# Altium schematic sheet System.SchDoc
size A3; SheetNumber: 1; SheetTotal: 14
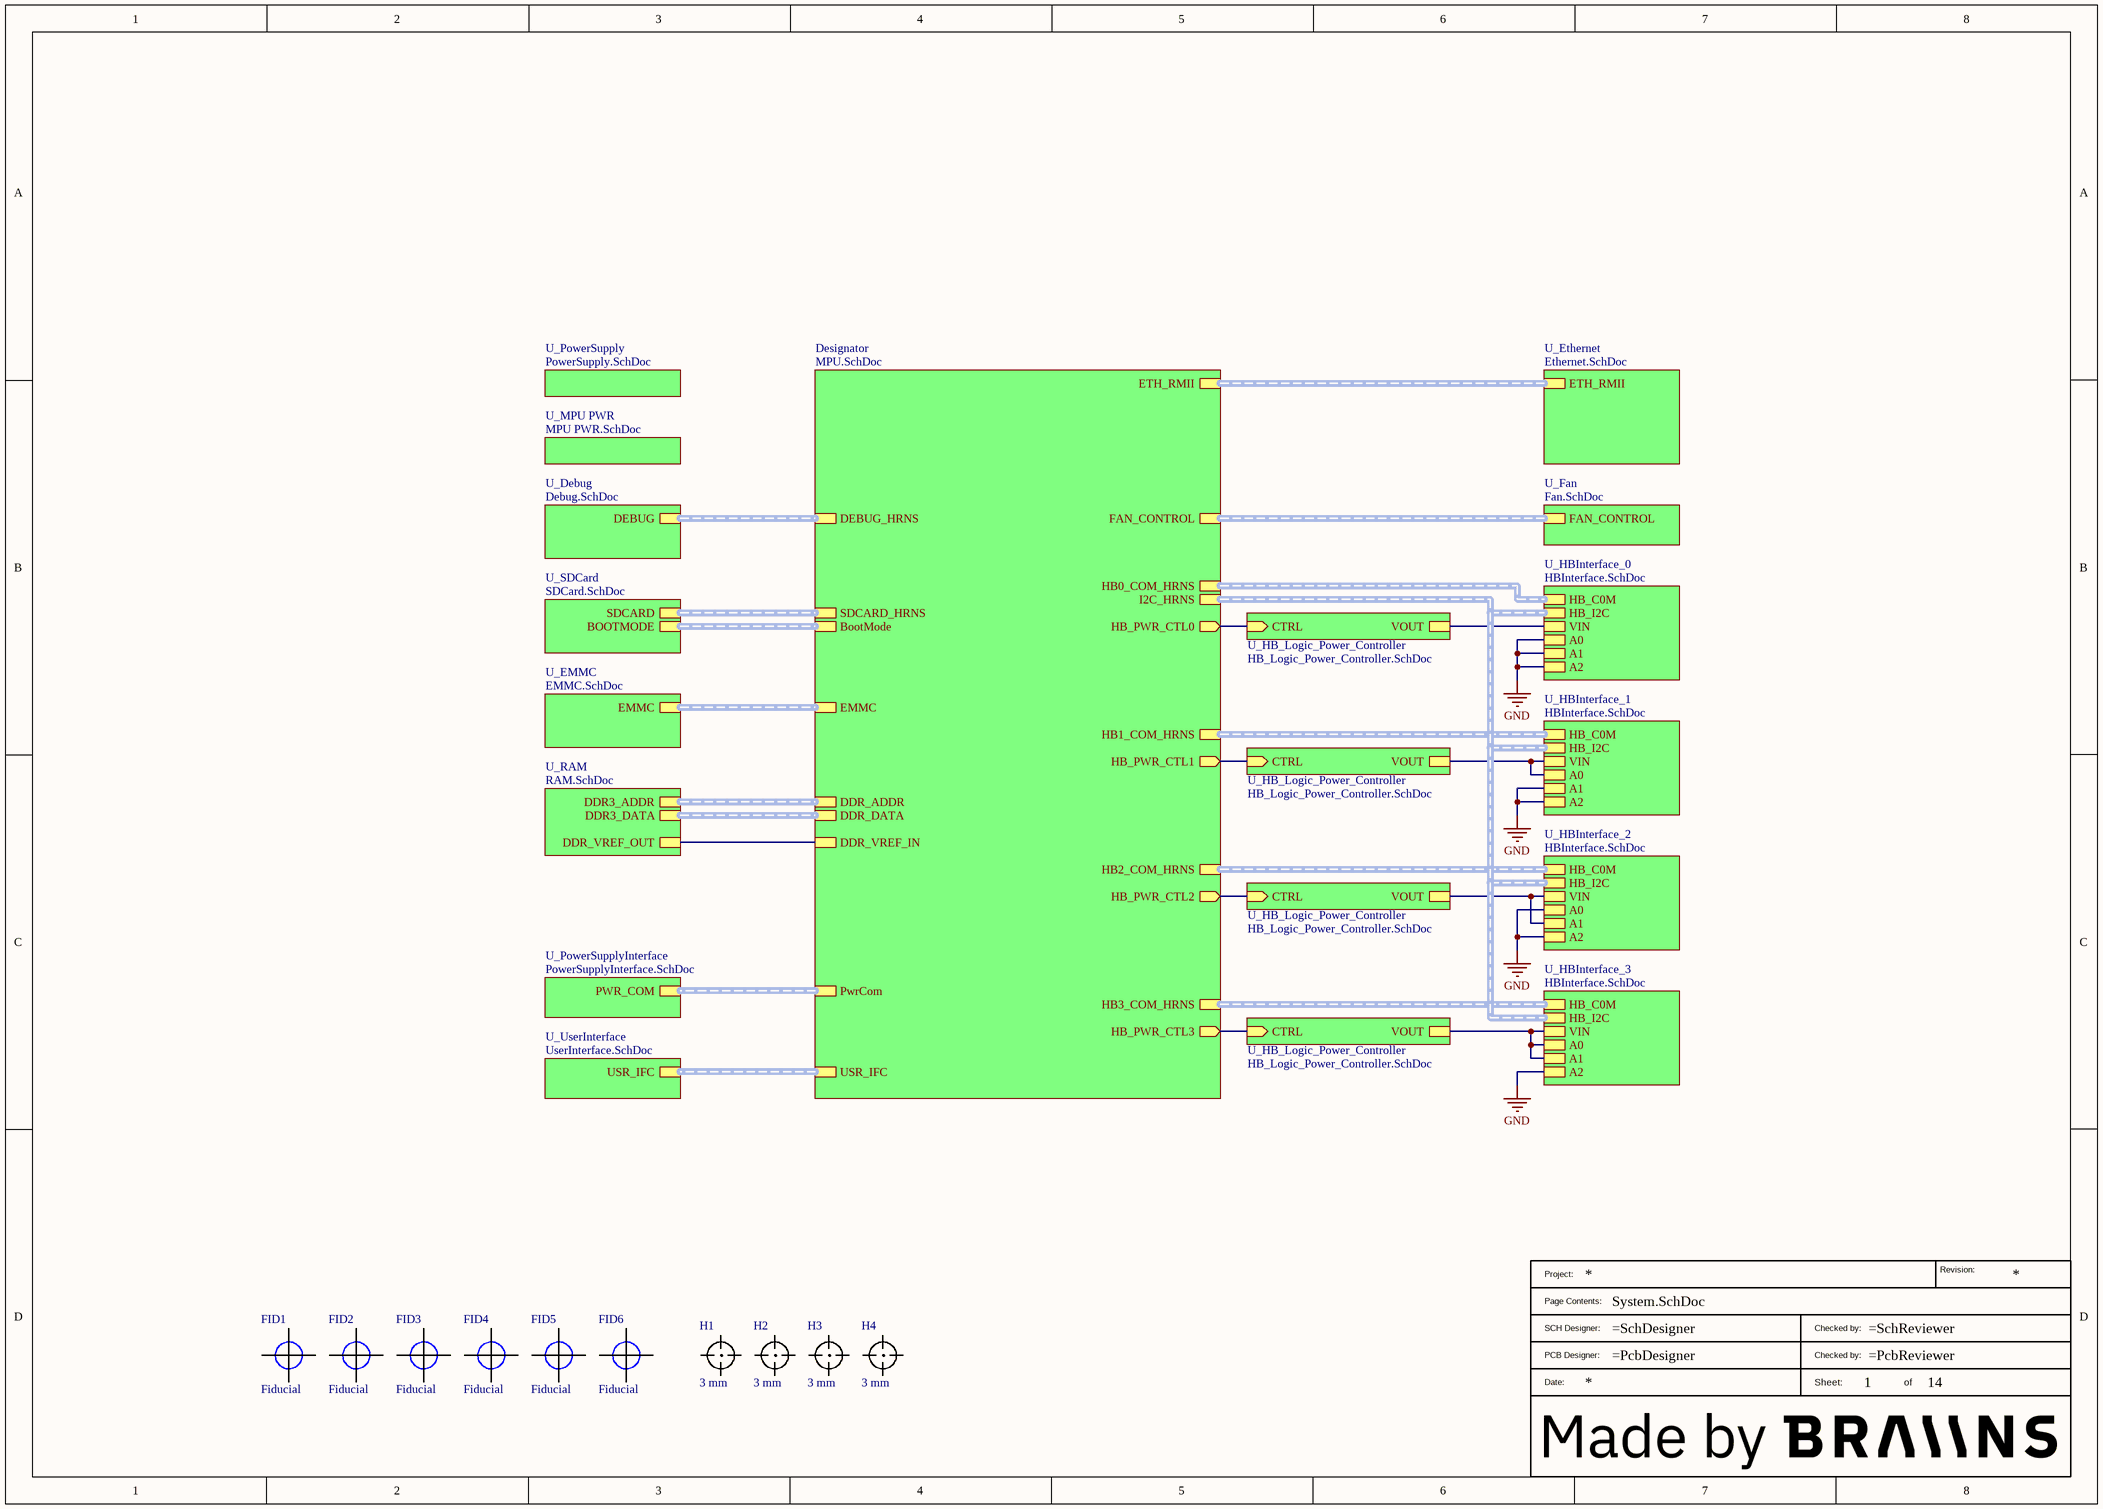
[diagram p0: System.SchDoc]

## Parts
?  BraiinsTitleBlockWithLogo  (value not drawn)  (graphical)
FID1  Fiducial  [FID_1MM]
FID2  Fiducial  [FID_1MM]
FID3  Fiducial  [FID_1MM]
FID4  Fiducial  [FID_1MM]
FID5  Fiducial  [FID_1MM]
FID6  Fiducial  [FID_1MM]
H1  3 mm  [THT_HOLE_NONPLATE_3_0]
H2  3 mm  [THT_HOLE_NONPLATE_3_0]
H3  3 mm  [THT_HOLE_NONPLATE_3_0]
H4  3 mm  [THT_HOLE_NONPLATE_3_0]

## Sub-sheets
Designator = MPU.SchDoc: DDR_ADDR (harness DDR_ADDR), DEBUG_HRNS (harness DEBUG_HRNS), DDR_DATA (harness DDR_DATA), DDR_VREF_IN, SDCARD_HRNS (harness SDCARD_HRNS), EMMC (harness EMMC), ETH_RMII (harness ETH_RMII), HB2_COM_HRNS (harness HB_COM_HRNS), HB3_COM_HRNS (harness HB_COM_HRNS), HB0_COM_HRNS (harness HB_COM_HRNS), HB1_COM_HRNS (harness HB_COM_HRNS), PwrCom (harness PwrCom), I2C_HRNS (harness I2C_HRNS), FAN_CONTROL (harness FAN_CONTROL), BootMode (harness BootMode), USR_IFC (harness USR_IFC), HB_PWR_CTL2 (out), HB_PWR_CTL1 (out), HB_PWR_CTL3 (out), HB_PWR_CTL0 (out)
U_Debug = Debug.SchDoc: DEBUG (harness DEBUG_HRNS)
U_EMMC = EMMC.SchDoc: EMMC (harness EMMC)
U_Ethernet = Ethernet.SchDoc: ETH_RMII (harness ETH_RMII)
U_Fan = Fan.SchDoc: FAN_CONTROL (harness FAN_CONTROL)
U_HB_Logic_Power_Controller = HB_Logic_Power_Controller.SchDoc: VOUT, CTRL (in)
U_HB_Logic_Power_Controller = HB_Logic_Power_Controller.SchDoc: VOUT, CTRL (in)
U_HB_Logic_Power_Controller = HB_Logic_Power_Controller.SchDoc: VOUT, CTRL (in)
U_HB_Logic_Power_Controller = HB_Logic_Power_Controller.SchDoc: VOUT, CTRL (in)
U_HBInterface_0 = HBInterface.SchDoc: HB_C0M (harness HB_COM_HRNS), HB_I2C (harness I2C_HRNS), A0, A1, A2, VIN
U_HBInterface_1 = HBInterface.SchDoc: HB_C0M (harness HB_COM_HRNS), HB_I2C (harness I2C_HRNS), A0, A1, A2, VIN
U_HBInterface_2 = HBInterface.SchDoc: HB_C0M (harness HB_COM_HRNS), HB_I2C (harness I2C_HRNS), A0, A1, A2, VIN
U_HBInterface_3 = HBInterface.SchDoc: HB_C0M (harness HB_COM_HRNS), HB_I2C (harness I2C_HRNS), A0, A1, A2, VIN
U_MPU PWR = MPU PWR.SchDoc: no entries
U_PowerSupply = PowerSupply.SchDoc: no entries
U_PowerSupplyInterface = PowerSupplyInterface.SchDoc: PWR_COM (harness PwrCom)
U_RAM = RAM.SchDoc: DDR3_ADDR (harness DDR_ADDR), DDR3_DATA (harness DDR_DATA), DDR_VREF_OUT
U_SDCard = SDCard.SchDoc: SDCARD (harness SDCARD_HRNS), BOOTMODE (harness BootMode)
U_UserInterface = UserInterface.SchDoc: USR_IFC (harness USR_IFC)

## Nets
GND: sheet U_HBInterface_0/A0, sheet U_HBInterface_0/A1, sheet U_HBInterface_0/A2, sheet U_HBInterface_1/A1, sheet U_HBInterface_1/A2, sheet U_HBInterface_2/A0, sheet U_HBInterface_2/A2, sheet U_HBInterface_3/A2
(unnamed): sheet Designator/DDR_VREF_IN, sheet U_RAM/DDR_VREF_OUT
(unnamed): sheet Designator/HB_PWR_CTL2, sheet U_HB_Logic_Power_Controller/CTRL
(unnamed): sheet Designator/HB_PWR_CTL1, sheet U_HB_Logic_Power_Controller/CTRL
(unnamed): sheet Designator/HB_PWR_CTL3, sheet U_HB_Logic_Power_Controller/CTRL
(unnamed): sheet Designator/HB_PWR_CTL0, sheet U_HB_Logic_Power_Controller/CTRL
(unnamed): sheet U_HBInterface_0/VIN, sheet U_HB_Logic_Power_Controller/VOUT
(unnamed): sheet U_HBInterface_1/A0, sheet U_HBInterface_1/VIN, sheet U_HB_Logic_Power_Controller/VOUT
(unnamed): sheet U_HBInterface_2/A1, sheet U_HBInterface_2/VIN, sheet U_HB_Logic_Power_Controller/VOUT
(unnamed): sheet U_HBInterface_3/A0, sheet U_HBInterface_3/A1, sheet U_HBInterface_3/VIN, sheet U_HB_Logic_Power_Controller/VOUT

## Buses and harness runs
harness sheet Designator/BootMode = sheet U_SDCard/BOOTMODE
harness sheet Designator/DDR_ADDR = sheet U_RAM/DDR3_ADDR
harness sheet Designator/DDR_DATA = sheet U_RAM/DDR3_DATA
harness sheet Designator/DEBUG_HRNS = sheet U_Debug/DEBUG
harness sheet Designator/EMMC = sheet U_EMMC/EMMC
harness sheet Designator/ETH_RMII = sheet U_Ethernet/ETH_RMII
harness sheet Designator/FAN_CONTROL = sheet U_Fan/FAN_CONTROL
harness sheet Designator/HB0_COM_HRNS = sheet U_HBInterface_0/HB_C0M
harness sheet Designator/HB1_COM_HRNS = sheet U_HBInterface_1/HB_C0M
harness sheet Designator/HB2_COM_HRNS = sheet U_HBInterface_2/HB_C0M
harness sheet Designator/HB3_COM_HRNS = sheet U_HBInterface_3/HB_C0M
harness sheet Designator/I2C_HRNS = sheet U_HBInterface_0/HB_I2C = sheet U_HBInterface_1/HB_I2C = sheet U_HBInterface_2/HB_I2C = sheet U_HBInterface_3/HB_I2C
harness sheet Designator/PwrCom = sheet U_PowerSupplyInterface/PWR_COM
harness sheet Designator/SDCARD_HRNS = sheet U_SDCard/SDCARD
harness sheet Designator/USR_IFC = sheet U_UserInterface/USR_IFC

## Notes on the sheet
- (in symbol BraiinsTitleBlockWithLogo) Revision:; Project:; Page Contents:; SCH Designer:; Checked by:; PCB Designer:; Date:; Sheet:; of

## Library data of the parts
FID1-FID6 = 30186: Fiducial 1mm; Part_Type: Other; Part_Status: New; ID: 30186; Updated By: janjuranek; Manufacturer Part Description: Fiducial 1mm; Created By: janjuranek; Created_Date: 2023-05-23 18:24:59; Updated_Date: 2023-05-23 18:25:39; ComponentLink1Description: Datasheet; ComponentLink2Description: Supplier Part Details
H1-H4 = 30117: Mechanical hole, non plated; Part_Status: New; ID: 30117; Updated By: janjuranek; Value: 3 mm; Part_Type: Mechanical; Manufacturer Part Description: Mechanical hole, non plated; Created By: janjuranek; Created_Date: 2023-03-17 21:20:29; Updated_Date: 2023-03-17 21:20:49; ComponentLink1Description: Datasheet; ComponentLink2Description: Supplier Part Details